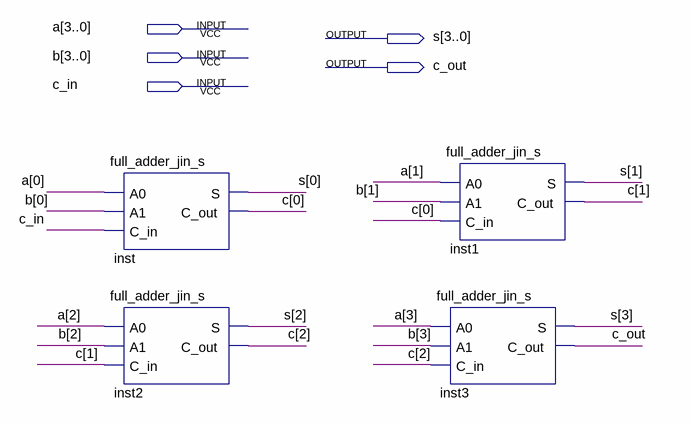
[diagram p0: schematic sheet]
// Quartus schematic adder_4b_jin_s.bdf as structural Verilog: 4 symbols, 5 pins
module adder_4b_jin_s (
  input  [3:0] a,
  input  [3:0] b,
  input  c_in,
  output [3:0] s,
  output c_out
);

  wire [2:0] c;

  full_adder_jin_s inst (.A0(a[0]), .A1(b[0]), .C_in(c_in), .S(s[0]), .C_out(c[0]));
  full_adder_jin_s inst2 (.A0(a[2]), .A1(b[2]), .C_in(c[1]), .S(s[2]), .C_out(c[2]));
  full_adder_jin_s inst1 (.A0(a[1]), .A1(b[1]), .C_in(c[0]), .S(s[1]), .C_out(c[1]));
  full_adder_jin_s inst3 (.A0(a[3]), .A1(b[3]), .C_in(c[2]), .S(s[3]), .C_out(c_out));
endmodule
